# EAGLE design Senser_ver.1 (EAGLE 6.6.0)
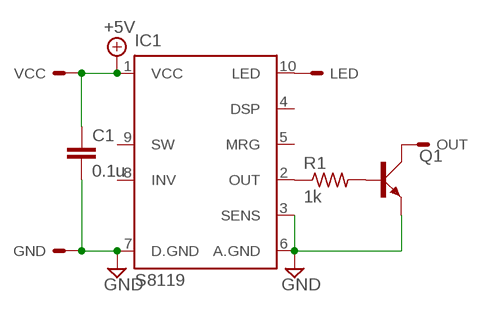
[diagram p0: schematic, sheet 1]

## Parts
C1  0.1u  CC1608  [C1608]
GND  PAD  [PAD]
IC1  S8119  [S8119]
LED  PAD  [PAD]
OUT  PAD  [PAD]
Q1  2SC2712  2SC1815SOT  [SOT23]
R1  1k  R-US_R1608  [R1608]
VCC  PAD  [PAD]

## Nets
+5V: C1.1 IC1.1(VCC) VCC.2(S)
GND: C1.2 GND.2(S) IC1.3(SENS) IC1.6(A.GND) IC1.7(D.GND) Q1.2(E)
LED: IC1.10(LED) LED.2(S)
N$1: IC1.2(OUT) R1.1
N$2: Q1.1(B) R1.2
N$3: OUT.2(S) Q1.3(C)
Unconnected: IC1.4(DSP) IC1.5(MRG) IC1.8(INV) IC1.9(SW)

## Library data of the parts
C1 = Capacitor:C: CAPACITOR naming: grid - package width
GND LED OUT VCC = Pinhead:PAD
IC1 = PhotoIC:S8119
Q1 = Transistor_NPN:2SC1815: NPN TRANSISTOR
R1 = Registor:R-US_: RESISTOR, American symbol

## Board
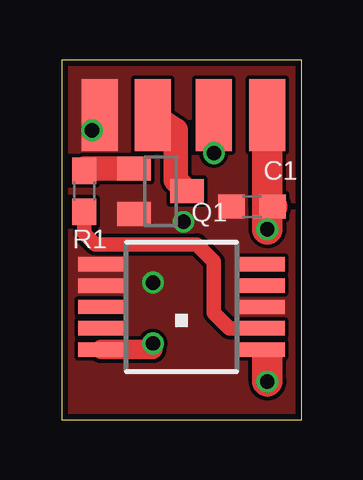
[diagram p1: board, top side]
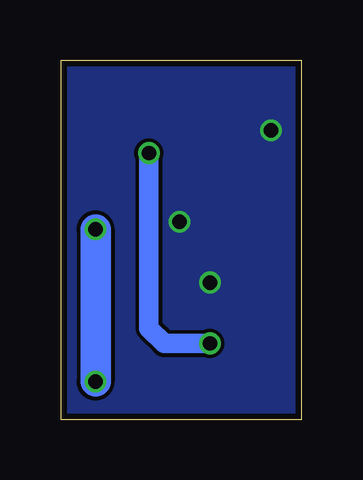
[diagram p2: board, bottom side, seen from below]

Size 10 x 15 mm. Coordinates in mm from the lower left corner, seen from the top.
Outline: 0,0 10,0 10,15 0,15 0,0
Copper layers (1*16): Top 0.035mm / dielectric 1.5mm / Bottom 0.035mm
Design rules "SeeedStudio_2layer_DRU_no_angle_20140221a": minimum track width 6mil, minimum drill 12mil, track to track 6mil, track to pad 6mil, pad to pad 6mil, via to via 6mil, smd to smd 0mil, copper to edge 10mil, drill to drill 10mil, minimum pad ring 10mil, minimum via ring 6mil, stop-mask expansion 2mil, vias tented up to drill 25mil, thermal gap 10mil

### Footprints (pad centres in the part's own frame; a part is rotated, then mirrored left to right if it is on the bottom)
C1608 = smd 1.1 x 1: 1 -0.85,0; 2 0.85,0
PAD = smd 1.5 x 3: 2 0,-0.635
S8119 = smd 0.6 x 1.9: 1 -1.78,-3.35; 2 -0.89,-3.35; 3 0,-3.35; 4 0.89,-3.35; 5 1.78,-3.35; 6 1.78,3.35; 7 0.89,3.35; 8 0,3.35; 9 -0.89,3.35; 10 -1.78,3.35
SOT23 = smd 1 x 1.4: 1 -0.95,-1.1; 2 0.95,-1.1; 3 0,1.1
R1608 = smd 1.1 x 1: 1 -0.85,0; 2 0.85,0

### Placement (x,y rotation side)
C1  7.94,8.89 180 top
GND  1.59,13.34 0 top
IC1  5,4.7 90 top
LED  6.35,13.34 0 top
OUT  3.81,13.34 0 top
Q1  4.13,9.53 270 top
R1  0.95,9.53 90 top
VCC  8.57,13.34 0 top

### Tracks (layer width: path | path; a pad name or v marks a point on that pad's centre or on a via)
+5V  (via drill 0.6)
  Top 0.406: IC1.1 8.57,2.92 8.57,2.54
  Top 1.27: 8.57,8.89 VCC.2 | C1.1 8.57,8.89 | 8.57,8.89 v8.57,7.94 | v8.57,1.59 8.57,2.54
  Bottom 1.27: v8.57,7.94 v8.57,1.59
GND  (via drill 0.6)
  other vias: 1.27,12.06 5.08,8.26 3.81,5.71
  pour Bottom (no thermals): 0,15.24 0,0 10.16,0 10.16,15.24
  pour Top (no thermals): 0,15.24 0,0 10.16,0 10.16,15.24
LED  (via drill 0.6)
  Top 0.813: LED.2 v6.35,11.11 | IC1.10 3.81,2.92 v3.81,3.17
  Bottom 0.813: v6.35,11.11 6.35,3.81 5.71,3.17 v3.81,3.17
N$1
  Top 0.61: R1.1 0.95,7.75 1.4,7.3 5.64,7.3 6.35,6.59 6.35,4.45 6.99,3.81 IC1.2
N$2
  Top 1.016: Q1.1 0.95,10.47 R1.2
N$3
  Top 1.016: OUT.2 4.76,12.06 4.76,9.99 Q1.3